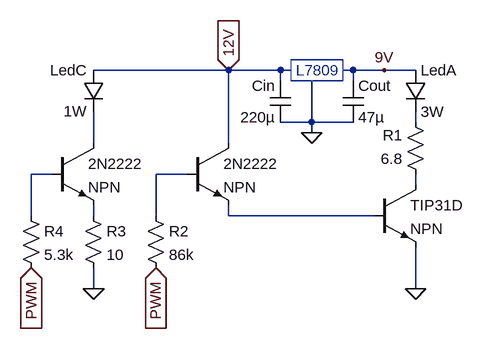
[diagram p0: schematic esquematico.asc]
esquematico.asc, the LTspice schematic file:
Version 4
SHEET 1 880 680
WIRE 288 80 80 80
WIRE 368 80 288 80
WIRE 384 80 368 80
WIRE 480 80 464 80
WIRE 528 80 480 80
WIRE 576 80 528 80
WIRE 368 96 368 80
WIRE 480 96 480 80
WIRE 416 160 416 96
WIRE 416 160 368 160
WIRE 480 160 416 160
WIRE 576 160 576 144
WIRE 416 176 416 160
WIRE 80 192 80 144
WIRE 288 192 288 80
WIRE 16 240 -16 240
WIRE 224 240 176 240
WIRE 576 256 576 240
WIRE -16 304 -16 240
WIRE 80 304 80 288
WIRE 176 304 176 240
WIRE 288 304 288 288
WIRE 512 304 288 304
WIRE 80 416 80 384
WIRE 576 416 576 352
FLAG 80 416 0
FLAG 576 416 0
FLAG 416 176 0
FLAG 528 80 9V
FLAG 288 80 12V
IOPIN 288 80 In
FLAG -16 384 PWM
IOPIN -16 384 In
FLAG 176 384 PWM
IOPIN 176 384 In
SYMBOL diode 64 80 R0
WINDOW 0 -51 0 Left 2
WINDOW 3 -30 63 Left 2
SYMATTR InstName LedC
SYMATTR Value 1W
SYMBOL diode 560 80 R0
SYMATTR InstName LedA
SYMATTR Value 3W
SYMBOL npn 16 192 R0
SYMATTR InstName 2N2222
SYMBOL npn 224 192 R0
SYMATTR InstName 2N2222
SYMBOL res 592 256 R180
WINDOW 0 36 76 Left 2
WINDOW 3 36 40 Left 2
SYMATTR InstName R1
SYMATTR Value 6.8
SYMBOL npn 512 256 R0
SYMATTR InstName TIP31D
SYMBOL res 160 288 R0
SYMATTR InstName R2
SYMATTR Value 86k
SYMBOL res 64 288 R0
SYMATTR InstName R3
SYMATTR Value 10
SYMBOL res -32 288 R0
SYMATTR InstName R4
SYMATTR Value 5.3k
SYMBOL cap 384 160 R180
WINDOW 0 24 56 Left 2
WINDOW 3 24 8 Left 2
SYMATTR InstName Cin
SYMATTR Value 220µ
SYMBOL cap 464 96 R0
SYMATTR InstName Cout
SYMATTR Value 47µ
TEXT 392 80 Left 2 ;L7809
RECTANGLE Normal 464 64 384 96

The netlist it stands for:
* esquematico.asc
D§LedC 12V N002 1W
D§LedA 9V N001 3W
Q§2N2222 N002 N003 N006 0 NPN
Q§2N2222 12V N004 N007 0 NPN
R1 N005 N001 6.8
Q§TIP31D N005 N007 0 0 NPN
R2 N004 PWM 86k
R3 N006 0 10
R4 N003 PWM 5.3k
Cin 0 12V 220µ
Cout 9V 0 47µ
.model D D
.lib standard.dio
.model NPN NPN
.model PNP PNP
.lib standard.bjt
* L7809
.backanno
.end